# Altium schematic sheet Output_Connector.SchDoc
size A4; Organization: Altium Limited; Address1: L3, 12a Rodborough Rd; Address2: Frenchs Forest; Address3: NSW; Address4: Australia 2086
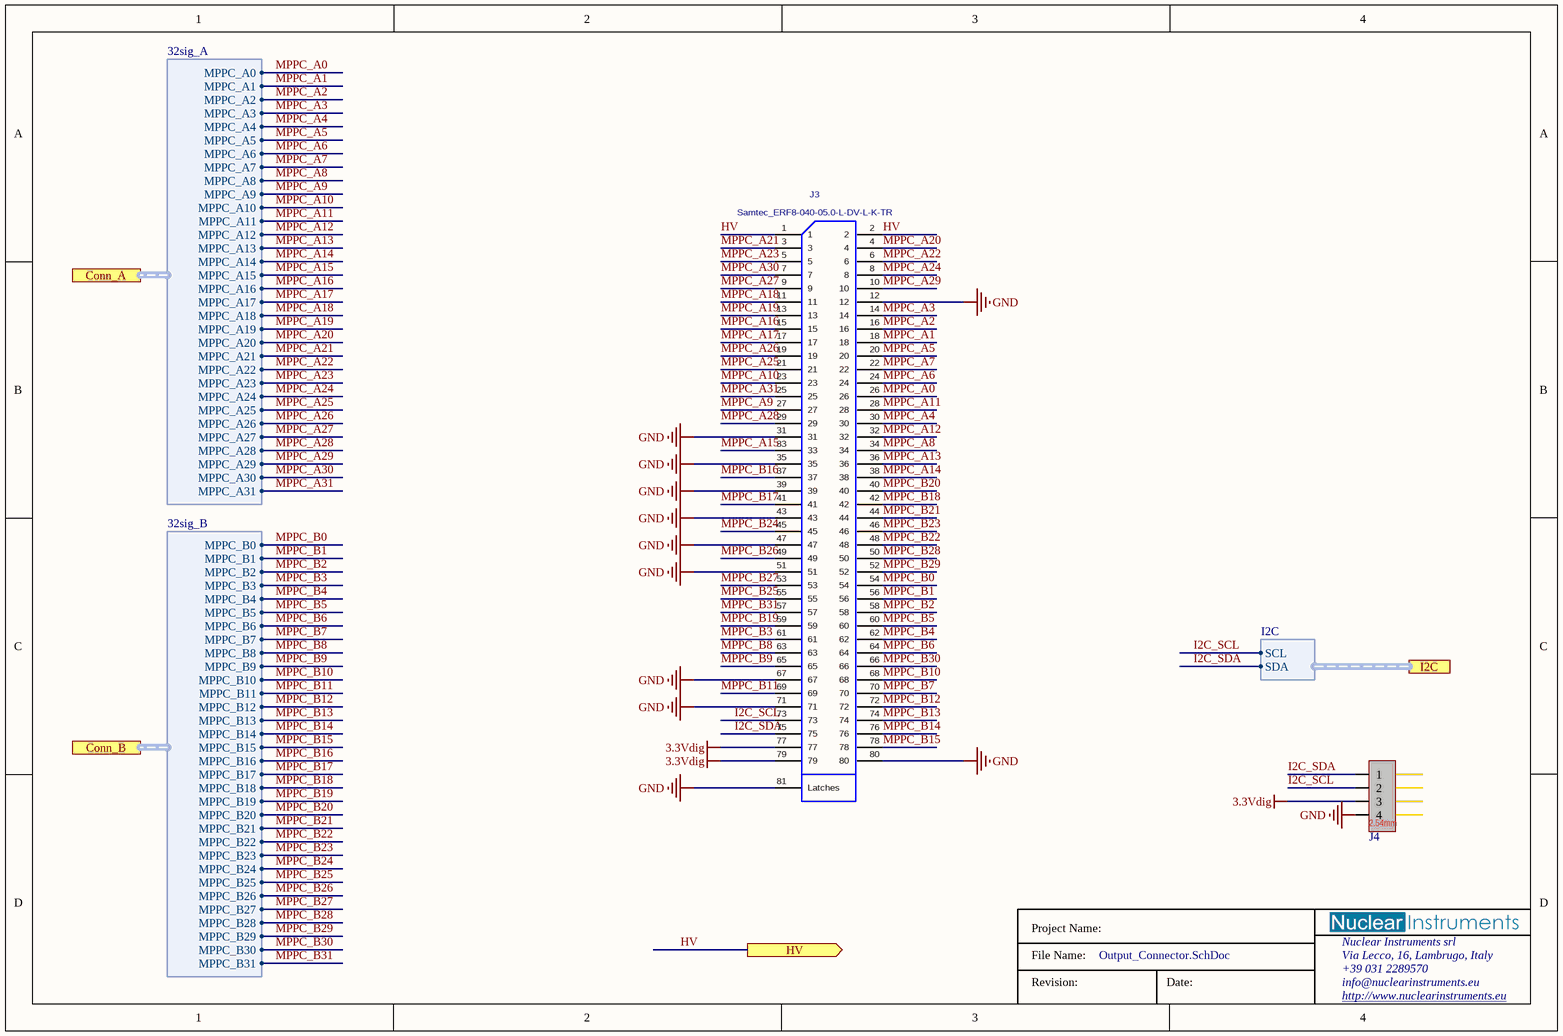
[diagram p0: Output_Connector.SchDoc]

## Parts
J3  Samtec_ERF8-040-05.0-L-DV-L-K-TR  [Samtec_ERF8-040-05.0-L-DV-L-K-TR]
J4  4 way, 2.54mm pitch  [Wurth_WR-PHD_4way_2.54mm_male]  (value not drawn)

## Ports
Conn_A (harness 32sig_A), Conn_B (harness 32sig_B), HV (out), I2C (harness I2C)

## Harnesses
32sig_B: MPPC_B0, MPPC_B1, MPPC_B2, MPPC_B3, MPPC_B4, MPPC_B5, MPPC_B6, MPPC_B7, MPPC_B8, MPPC_B9, MPPC_B10, MPPC_B11, MPPC_B12, MPPC_B13, MPPC_B14, MPPC_B15, MPPC_B16, MPPC_B17, MPPC_B18, MPPC_B19, MPPC_B20, MPPC_B21, MPPC_B22, MPPC_B23, MPPC_B24, MPPC_B25, MPPC_B26, MPPC_B27, MPPC_B28, MPPC_B29, MPPC_B30, MPPC_B31
32sig_A: MPPC_A0, MPPC_A1, MPPC_A2, MPPC_A3, MPPC_A4, MPPC_A5, MPPC_A6, MPPC_A7, MPPC_A8, MPPC_A9, MPPC_A10, MPPC_A11, MPPC_A12, MPPC_A13, MPPC_A14, MPPC_A15, MPPC_A16, MPPC_A17, MPPC_A18, MPPC_A19, MPPC_A20, MPPC_A21, MPPC_A22, MPPC_A23, MPPC_A24, MPPC_A25, MPPC_A26, MPPC_A27, MPPC_A28, MPPC_A29, MPPC_A30, MPPC_A31
I2C: SCL, SDA

## Nets
3.3Vdig: J3.77 J3.79 J4.3
GND: J3.12 J3.31 J3.35 J3.39 J3.43 J3.47 J3.51 J3.67 J3.71 J3.80 J3.81(Latches) J4.4
HV: J3.1 J3.2 ; port HV
I2C_SCL: J3.73 J4.2 ; port I2C.SCL
I2C_SDA: J3.75 J4.1 ; port I2C.SDA
MPPC_A0: J3.26 ; port Conn_A.MPPC_A0
MPPC_A1: J3.18 ; port Conn_A.MPPC_A1
MPPC_A2: J3.16 ; port Conn_A.MPPC_A2
MPPC_A3: J3.14 ; port Conn_A.MPPC_A3
MPPC_A4: J3.30 ; port Conn_A.MPPC_A4
MPPC_A5: J3.20 ; port Conn_A.MPPC_A5
MPPC_A6: J3.24 ; port Conn_A.MPPC_A6
MPPC_A7: J3.22 ; port Conn_A.MPPC_A7
MPPC_A8: J3.34 ; port Conn_A.MPPC_A8
MPPC_A9: J3.27 ; port Conn_A.MPPC_A9
MPPC_A10: J3.23 ; port Conn_A.MPPC_A10
MPPC_A11: J3.28 ; port Conn_A.MPPC_A11
MPPC_A12: J3.32 ; port Conn_A.MPPC_A12
MPPC_A13: J3.36 ; port Conn_A.MPPC_A13
MPPC_A14: J3.38 ; port Conn_A.MPPC_A14
MPPC_A15: J3.33 ; port Conn_A.MPPC_A15
MPPC_A16: J3.15 ; port Conn_A.MPPC_A16
MPPC_A17: J3.17 ; port Conn_A.MPPC_A17
MPPC_A18: J3.11 ; port Conn_A.MPPC_A18
MPPC_A19: J3.13 ; port Conn_A.MPPC_A19
MPPC_A20: J3.4 ; port Conn_A.MPPC_A20
MPPC_A21: J3.3 ; port Conn_A.MPPC_A21
MPPC_A22: J3.6 ; port Conn_A.MPPC_A22
MPPC_A23: J3.5 ; port Conn_A.MPPC_A23
MPPC_A24: J3.8 ; port Conn_A.MPPC_A24
MPPC_A25: J3.21 ; port Conn_A.MPPC_A25
MPPC_A26: J3.19 ; port Conn_A.MPPC_A26
MPPC_A27: J3.9 ; port Conn_A.MPPC_A27
MPPC_A28: J3.29 ; port Conn_A.MPPC_A28
MPPC_A29: J3.10 ; port Conn_A.MPPC_A29
MPPC_A30: J3.7 ; port Conn_A.MPPC_A30
MPPC_A31: J3.25 ; port Conn_A.MPPC_A31
MPPC_B0: J3.54 ; port Conn_B.MPPC_B0
MPPC_B1: J3.56 ; port Conn_B.MPPC_B1
MPPC_B2: J3.58 ; port Conn_B.MPPC_B2
MPPC_B3: J3.61 ; port Conn_B.MPPC_B3
MPPC_B4: J3.62 ; port Conn_B.MPPC_B4
MPPC_B5: J3.60 ; port Conn_B.MPPC_B5
MPPC_B6: J3.64 ; port Conn_B.MPPC_B6
MPPC_B7: J3.70 ; port Conn_B.MPPC_B7
MPPC_B8: J3.63 ; port Conn_B.MPPC_B8
MPPC_B9: J3.65 ; port Conn_B.MPPC_B9
MPPC_B10: J3.68 ; port Conn_B.MPPC_B10
MPPC_B11: J3.69 ; port Conn_B.MPPC_B11
MPPC_B12: J3.72 ; port Conn_B.MPPC_B12
MPPC_B13: J3.74 ; port Conn_B.MPPC_B13
MPPC_B14: J3.76 ; port Conn_B.MPPC_B14
MPPC_B15: J3.78 ; port Conn_B.MPPC_B15
MPPC_B16: J3.37 ; port Conn_B.MPPC_B16
MPPC_B17: J3.41 ; port Conn_B.MPPC_B17
MPPC_B18: J3.42 ; port Conn_B.MPPC_B18
MPPC_B19: J3.59 ; port Conn_B.MPPC_B19
MPPC_B20: J3.40 ; port Conn_B.MPPC_B20
MPPC_B21: J3.44 ; port Conn_B.MPPC_B21
MPPC_B22: J3.48 ; port Conn_B.MPPC_B22
MPPC_B23: J3.46 ; port Conn_B.MPPC_B23
MPPC_B24: J3.45 ; port Conn_B.MPPC_B24
MPPC_B25: J3.55 ; port Conn_B.MPPC_B25
MPPC_B26: J3.49 ; port Conn_B.MPPC_B26
MPPC_B27: J3.53 ; port Conn_B.MPPC_B27
MPPC_B28: J3.50 ; port Conn_B.MPPC_B28
MPPC_B29: J3.52 ; port Conn_B.MPPC_B29
MPPC_B30: J3.66 ; port Conn_B.MPPC_B30
MPPC_B31: J3.57 ; port Conn_B.MPPC_B31

## Notes on the sheet
- Project Name:
- Revision:
- File Name:
- Date:
- Nuclear Instruments srl
- Via Lecco, 16, Lambrugo, Italy
- +39 031 2289570
- info@nuclearinstruments.eu
- http://www.nuclearinstruments.eu
- (in symbol Wurth_WR-PHD_4way_2.54mm_male) 2.54mm

## Library data of the parts
J3 = Samtec_ERF8-040-05.0-L-DV-L-K-TR: 0.8mm Edge Rate Socket Assembly, Double Vertical Row, 40 Pins.
J4 = Wurth_WR-PHD_4way_2.54mm_male: Male 4 way 2.54 mm